# Altium project Servo-Board-v1.0.PrjPcb (part 2 of 19)

## Sheet Power_Sheet.SchDoc
size 420 x 297 mm; SheetNumber: 2; SheetTotal: 32
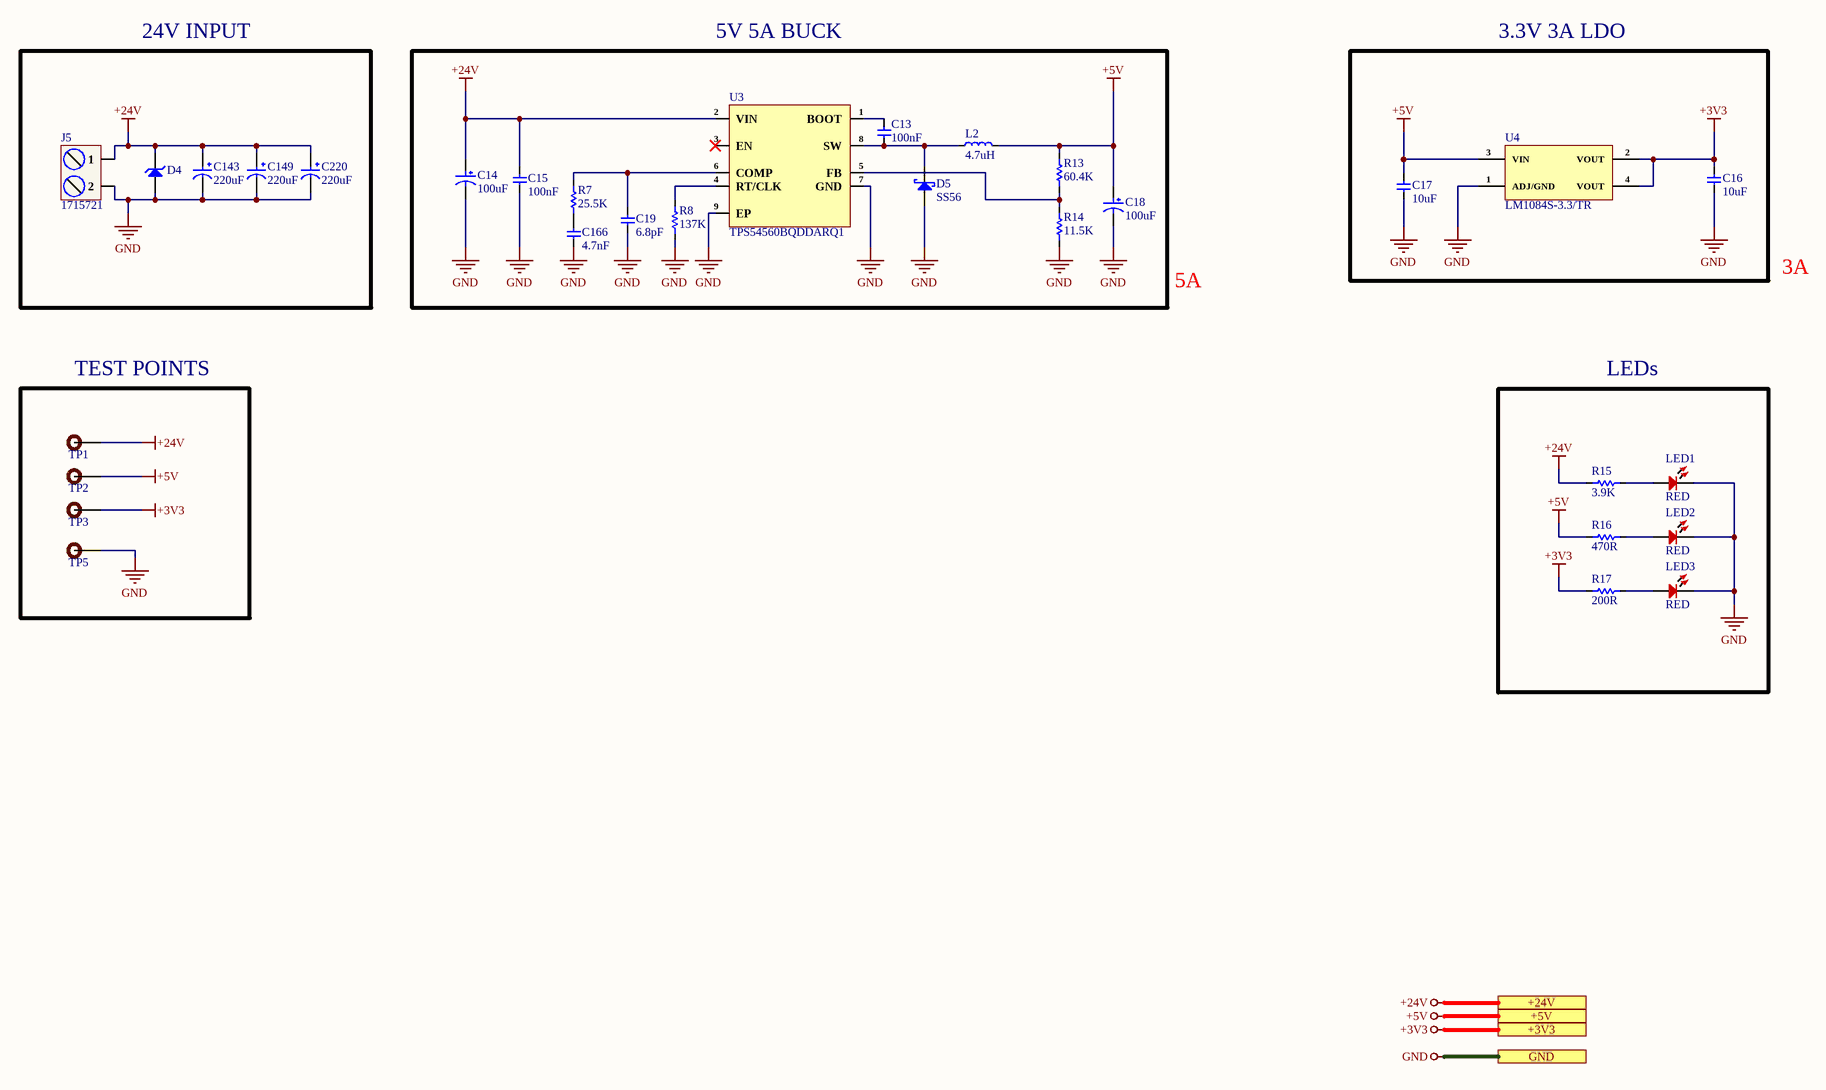
[diagram p2: Power_Sheet.SchDoc]

### Parts
C13  100nF  [cap-0402]
C14  100uF  [RVT1A101M0605]
C15  100nF  [cap-0402]
C16  10uF  [Cap-0603]
C17  10uF  [Cap-0603]
C18  100uF  [RVT1A101M0605]
C19  6.8pF  [Cap-0402]
C143  220uF  [UCD-220uF-10mmDia]
C149  220uF  [UCD-220uF-10mmDia]
C166  4.7nF  [Cap-0402]
C220  220uF  [UCD-220uF-10mmDia]
D4  SMBJ28A-13-F  [SMB_]  (value not drawn)
D5  SS56  [SMA]
J5  1715721  [1715721]
L2  4.7uH  [YSPI1050-4R7M]
LED1  RED  [LED-0603]
LED2  RED  [LED-0603]
LED3  RED  [LED-0603]
R7  25.5K  [Res-0402]
R8  137K  [Res-0402]
R13  60.4K  [Res-0402]
R14  11.5K  [Res-0402]
R15  3.9K  [Res-0402]
R16  470R  [Res-0402]
R17  200R  [Res-0402]
TP1  TEST POINT  [Test-point]  (value not drawn)  (no BOM)
TP2  TEST POINT  [Test-point]  (value not drawn)  (no BOM)
TP3  TEST POINT  [Test-point]  (value not drawn)  (no BOM)
TP5  TEST POINT  [Test-point]  (value not drawn)  (no BOM)
U3  TPS54560BQDDARQ1  [8-SO PowerPad]
U4  LM1084S-3.3/TR  [TO263-3_]

### Blocks framed on the sheet
24V INPUT: C143 C149 C220 D4 J5
5V 5A BUCK: C13-C15 C18 C19 C166 D5 L2 R7 R8 R13 R14 U3
3.3V 3A LDO: C16 C17 U4
TEST POINTS: TP1-TP3 TP5
LEDs: LED1-LED3 R15-R17

### Ports
+3V3 (see Top_Sheet[2A], CAN_Sheet[5D], Connector_Sheet[5D], Controller_Sheet[5D], Encoder_Sheet1[5D], Encoder_Sheet2[5D], Encoder_Sheet3[5D], Encoder_Sheet4[5D], EtherCAT_Sheet[5D], Motor_Driver_Sheet1[5D], Motor_Driver_Sheet2[5D], Motor_Driver_Sheet3[5D], Motor_Driver_Sheet4[5D], RJ45_Sheet[5D], RS485_RS232_Sheet[3D], Sec_Controller_Sheet1[5D], Sec_Controller_Sheet2[5D], Sec_Controller_Sheet3[5D], Sec_Controller_Sheet4[5D]), +5V (see Top_Sheet[2A], CAN_Sheet[5D], DIO_1[5D], DIO_2[5D], DIO_3[5D], DIO_4[5D], Encoder_Sheet1[5D], Encoder_Sheet2[5D], Encoder_Sheet3[5D], Encoder_Sheet4[5D]), +24V (see Top_Sheet[2A], Connector_Sheet[5D], DIO_1[5D], DIO_2[5D], DIO_3[5D], DIO_4[5D], MOSFET_Driver_Sheet1[5D], MOSFET_Driver_Sheet2[5D], MOSFET_Driver_Sheet3[5D], MOSFET_Driver_Sheet4[5D], Motor_Driver_Sheet1[5D], Motor_Driver_Sheet2[5D], Motor_Driver_Sheet3[5D], Motor_Driver_Sheet4[5D]), GND (see Top_Sheet[2A], CAN_Sheet[5D], Connector_Sheet[5D], Controller_Sheet[5D], DIO_1[5D], DIO_2[5D], DIO_3[5D], DIO_4[5D], Encoder_Sheet1[5D], Encoder_Sheet2[5D], Encoder_Sheet3[5D], Encoder_Sheet4[5D], EtherCAT_Sheet[5D], MOSFET_Driver_Sheet1[5D], MOSFET_Driver_Sheet2[5D], MOSFET_Driver_Sheet3[5D], MOSFET_Driver_Sheet4[5D], Motor_Driver_Sheet1[5D], Motor_Driver_Sheet2[5D], Motor_Driver_Sheet3[5D], Motor_Driver_Sheet4[5D], RJ45_Sheet[5D], RS485_RS232_Sheet[3D], Sec_Controller_Sheet1[5D], Sec_Controller_Sheet2[5D], Sec_Controller_Sheet3[5D], Sec_Controller_Sheet4[5D])

### Nets
+3V3: C16.2 R17.1 TP3.1 U4.2(VOUT) U4.4(VOUT) ; port +3V3
+5V: C17.2 C18.1 L2.2 R13.2 R16.1 TP2.1 U4.3(VIN) ; port +5V
+24V: C14.1 C15.2 C143.1 C149.1 C220.1 D4.2(K) J5.1 R15.1 TP1.1 U3.2(VIN) ; port +24V  [project net VDRAIN]
GND: C14.2 C15.1 C16.1 C17.1 C18.2 C19.1 C143.2 C149.2 C166.1 C220.2 D4.1(A) D5.2(A) J5.2 LED1.2 LED2.2 LED3.2 R8.1 R14.1 TP5.1 U3.7(GND) U3.9(EP) U4.1(ADJ/GND) ; port GND
NetC13_1: C13.1 D5.1(K) L2.1 U3.8(SW)
NetC13_2: C13.2 U3.1(BOOT)
NetC19_2: C19.2 R7.2 U3.6(COMP)
NetC166_2: C166.2 R7.1
NetLED1_1: LED1.1 R15.2
NetLED2_1: LED2.1 R16.2
NetLED3_1: LED3.1 R17.2
NetR8_2: R8.2 U3.4(RT/CLK)
NetR13_1: R13.1 R14.2 U3.5(FB)

Not connected (* = marked no-connect by the designer): U3 3(EN)*

### Notes on the sheet
- 3A
- 5A
- File:
- Title:
- Date:
- Page
- Num:
- Total:
- Drawn By: Huzaifa Ali

### Library data of the parts
C13 C15 = C1005X7R1H104KT000F: as C11 on sheet Controller_Sheet; Supplier 1: Avnet; Manufacturer Part Number: C1005X7R1H104KT000F; RoHS: No; Category: Ceramic Capacitors; Dielectric: X7R; Supplier Part Number 1: C1005X7R1H104KT000F; LCSC Part Number: C361198; ComponentLink1Description: LCSC; ComponentLink1URL: https://www.lcsc.com/product-detail/Multilayer-Ceramic-Capacitors-MLCC-SMD-SMT_TDK-C1005X7R1H104KT000F_C361198.html
C14 C18 = RVT1A101M0605: 100uF 10V 55mA@120Hz ±20% SMD,D6.3xL5.4mm Aluminum Electrolytic Capacitors - SMD ROHS; Manufacturer: ROQANG; Manufacturer Part Number: RVT1A101M0605; Package: SMD,D6.3xL5.4mm; LCSC Part Number: C72474; Item Type: Capacitor; ComponentLink1Description: LCSC; ComponentLink1URL: https://www.lcsc.com/product-detail/Aluminum-Electrolytic-Capacitors-SMD_ROQANG-RVT1A101M0605_C72474.html
C16 C17 = C1608X5R1E106M080AC: CAP CER 10UF 25V X5R 0603; Manufacturer: TDK; Dielectric Material: Ceramic; Tolerance: 20%; Item Type: Capacitor; Supplier 1: Digi-Key; Manufacturer Part Number: C1608X5R1E106M080AC; Stock 1: 61681; Pricing 1: 1=0.96, 10=0.704, 100=0.483, 500=0.38238, 1000=0.322 (USD); Mount: Surface Mount; Case/Package: 0603; Weight: 7.1E-05oz; Case Code (Imperial): 0603; Case Code (Metric): 1608; Min Operating Temperature: -55°C; Max Operating Temperature: 85°C; Capacitance: 10uF; Packaging: Tape and Reel; Voltage Rating: 25V; Voltage Rating (DC): 25V; Termination: SMD/SMT; Package Quantity: 1; Dielectric: X5R; Composition: Ceramic; Length: 1.6mm; Height: 0.8mm; Width: 0.8mm; Thickness: 0.039inch; Depth: 0.8mm; Lead Free: Lead Free; REACH SVHC: No SVHC; Supplier Part Number 1: 445-9015-1-ND; LCSC Part Number: C2168289
C19 = CC0402CRNPO9BN6R8: as C3 on sheet Controller_Sheet; Supplier: Future Electronics; Supplier Part Number: 3247368; Manufacturer Part Number: CC0402CRNPO9BN6R8; RoHS: Yes; Category: Ceramic Capacitors; Stock: 200000; Pricing: 10000=0.0024, 40000=0.0022, 150000=0.0021, 400000=0.002, 1000000=0.0019 (USD); Mounting Technology: Surface Mount; Case/Package: 0402; Case Code (Imperial): 0402; Case Code (Metric): 1005; Weight: 2.3E-05oz; Min Operating Temperature: -55°C; Max Operating Temperature: 125°C; Value: 6.8pF; Packaging: Tape and Reel; Voltage Rating: 50V; Voltage Rating (DC): 50V; Termination: SMD/SMT; Series: CC; Construction: Flat; Length: 1mm; Width: 0.5mm; Height: 0.5mm; Depth: 0.5mm; Radiation Hardening: No; RoHS Compliant: Yes; ComponentLink1URL: https://datasheet.ciiva.com/11587/upy-gp-np0-16v-to-50v-8-11587182.pdf?src-supplier=Avnet; ComponentLink1Description: https://datasheet.ciiva.com/11587/upy-gp-np0-16v-to-50v-8-11587182.pdf?src-supplier=Avnet; LCSC Part Number: C189470
C143 C149 C220 = UCD1H221MNL1GS: CAP ALUM 220UF 20% 50V SMD; Manufacturer: Nichicon; Ripple Current: 700mA; Impedance: 160mR; Leakage Current: 3uA; Life (Hours): 5000Hour; Dissipation Factor: 0.1%; Item Type: Capacitor; Supplier 1: Digi-Key; Manufacturer Part Number: UCD1H221MNL1GS; RoHS: Yes; Category: Aluminum Electrolytic Capacitors; Pricing 1: 1=0.85000, 10=0.60200, 50=0.45480, 100=0.39620 (USD); Mount: Surface Mount,PCB; Case/Package: Radial; Min Operating Temperature: -55°C; Max Operating Temperature: 105°C; Capacitance: 220uF; Tolerance: 20%; Voltage Rating: 50V; Packaging: Tape and Reel; Package Quantity: 1; Voltage Rating (DC): 50V; Termination: SMD/SMT; Voltage: 50V; Features: General Purpose; Series: CD; Construction: Cylindrical; Diameter: 10mm; Length: 10mm; Height: 10mm; Height - Seated (Max): 0.394inch; Radiation Hardening: No; Lead Free: Lead Free; RoHS Compliant: Yes; ComponentLink1URL: https://datasheet.ciiva.com/11776/0900766b80ebdadd-11776792.pdf?src-supplier=RSComponents; ComponentLink1Description: https://datasheet.ciiva.com/11776/0900766b80ebdadd-11776792.pdf?src-supplier=RSComponents; ComponentLink2URL: https://datasheet.ciiva.com/5362/e-cd-22158-5362489.pdf?src-supplier=Mouser; ComponentLink2Description: https://datasheet.ciiva.com/5362/e-cd-22158-5362489.pdf?src-supplier=Mouser; ComponentLink3URL: https://datasheet.ciiva.com/11684/e-cd-11684678.pdf?src-supplier=Avnet; ComponentLink3Description: https://datasheet.ciiva.com/11684/e-cd-11684678.pdf?src-supplier=Avnet; ComponentLink4URL: https://datasheet.ciiva.com/15037/e-cd-15037119.pdf?src-supplier=Digi-Key; ComponentLink4Description: https://datasheet.ciiva.com/15037/e-cd-15037119.pdf?src-supplier=Digi-Key; ComponentLink5URL: https://datasheet.ciiva.com/16393/e-cd-16393493.pdf?src-supplier=Future+Electronics; ComponentLink5Description: https://datasheet.ciiva.com/16393/e-cd-16393493.pdf?src-supplier=Future+Electronics; ComponentLink6URL: https://datasheet.ciiva.com/17354/e-cd-17354606.pdf?src-supplier=Avnet+Europe; ComponentLink6Description: https://datasheet.ciiva.com/17354/e-cd-17354606.pdf?src-supplier=Avnet+Europe; Supplier Part Number 1: 493-6390-1-ND; LCSC Part Number: C116211
C166 = CC0402KRX7R9BB472: CAP CER 4700PF 50V X7R 0402; Manufacturer: Yageo; Material: 4241ConductorMaterial; Tolerance: 10%; Temperature Coefficient: 30ppm/°C; Item Type: Capacitor; Supplier 1: Future Electronics; Manufacturer Part Number: CC0402KRX7R9BB472; RoHS: Yes; Category: Ceramic Capacitors; Stock 1: 1780000; Pricing 1: 10000=0.0021, 40000=0.002, 150000=0.0019, 400000=0.0018, 1000000=0.0017 (USD); Mount: Surface Mount; Case/Package: 0402; Number of Pins: 2NUMBER; Case Code (Imperial): 0402; Case Code (Metric): 1005; Min Operating Temperature: -55°C; Max Operating Temperature: 125°C; Capacitance: 4.7nF; Dielectric: X7R; Voltage Rating: 50V; Voltage Rating (DC): 50V; Packaging: Tape and Reel; Package Quantity: 1; Termination: SMD/SMT; Series: CC; Construction: Flat; Length: 1mm; Width: 0.02inch; Height: 0.5mm; Thickness: 0.022inch; Depth: 0.5mm; Radiation Hardening: No; Reach SVHC Compliant: No; RoHS Compliant: Yes; Halogen Free: 5694HalogenFree; Lead Free: 5697LeadFree; ComponentLink1URL: https://datasheet.ciiva.com/7978/1489800-7978108.pdf?src-supplier=Element14; ComponentLink1Description: https://datasheet.ciiva.com/7978/1489800-7978108.pdf?src-supplier=Element14; ComponentLink2URL: https://datasheet.ciiva.com/176/mlccorderingcode-176364.pdf?src-supplier=Digikey; ComponentLink2Description: https://datasheet.ciiva.com/176/mlccorderingcode-176364.pdf?src-supplier=Digikey; ComponentLink3URL: https://datasheet.ciiva.com/176/mlccorderingcode-176363.pdf?src-supplier=Digikey; ComponentLink3Description: https://datasheet.ciiva.com/176/mlccorderingcode-176363.pdf?src-supplier=Digikey; ComponentLink4URL: https://datasheet.ciiva.com/176/mlccorderingcode-176365.pdf?src-supplier=Digikey; ComponentLink4Description: https://datasheet.ciiva.com/176/mlccorderingcode-176365.pdf?src-supplier=Digikey; ComponentLink5URL: https://datasheet.ciiva.com/11586/upy-gphc-x7r-6-3v-to-50v-8-11586491.pdf?src-supplier=Avnet; ComponentLink5Description: https://datasheet.ciiva.com/11586/upy-gphc-x7r-6-3v-to-50v-8-11586491.pdf?src-supplier=Avnet; Supplier Part Number 1: 1989300
D4 = SMBJ28A-13-F: TVS DIODE 28VWM 45.4VC SMB; Manufacturer: Diodes; Test Current: 1mA; Number of Elements: 1; Power Dissipation: 600W; Forward Voltage: 5V; Direction: Unidirectional; Reverse Breakdown Voltage: 31.1V; Max Surge Current: 13.2A; Reverse Standoff Voltage: 28V; Clamping Voltage: 45.4V; Power Line Protection: No; Breakdown Voltage: 35.8V; Max Reverse Leakage Current: 5uA; Value: 330pF; Diode Type: ZENER; Supplier: Future Electronics; Supplier Part Number: 8797342; Manufacturer Part Number: SMBJ28A-13-F; RoHS: Yes; Category: TVS Diodes; Stock: 39000; Pricing: 3000=0.0734, 9000=0.0706, 15000=0.0693, 30000=0.0676, 60000=0.065 (USD); Mounting Technology: Surface Mount; Case/Package: SMB; Pins: 2; Min Operating Temperature: -55°C; Max Operating Temperature: 150°C; Packaging: Tape and Reel; Package Quantity: 3000; Max Power Dissipation: 600W; Series: SMBJ; Number of Unidirectional Channels: 1; Min Breakdown Voltage: 31.1V; Peak Pulse Power: 600W; Polarity: Unidirectional; Termination: SMD/SMT; Peak Pulse Current: 13.2A; Max Breakdown Voltage: 35.8V; Leakage Current: 5uA; Working Voltage: 28V; Voltage Rating (DC): 28V; Max Output current: 13.2A; Clamping Voltage-Max: 45.4V; Length: 4.57mm; Width: 3.9mm; Height: 2.62mm; Radiation Hardening: No; RoHS Compliant: Yes; Lead Free: Lead Free; ComponentLink1URL: https://datasheet.ciiva.com/16387/ds19002-16387564.pdf?src-supplier=Future+Electronics; ComponentLink1Description: https://datasheet.ciiva.com/16387/ds19002-16387564.pdf?src-supplier=Future+Electronics; ComponentLink2URL: https://datasheet.ciiva.com/26912/getdatasheetpartid-234000-26912533.pdf?src-supplier=Verical; ComponentLink2Description: https://datasheet.ciiva.com/26912/getdatasheetpartid-234000-26912533.pdf?src-supplier=Verical; Item Type: Diode
D5 = SS56: DIODE SCHOTTKY 60V 5A SMA; Manufacturer: MDD; LCSC Par Number: C65009; Manufacturer Part Number: SS56; Iterm Type: Diode; ComponentLink1Description: LCSC; ComponentLink1URL: https://www.lcsc.com/product-detail/Schottky-Barrier-Diodes-SBD_MDD-Microdiode-Electronics-SS56_C65009.html
J5 = 1715721: TERM BLK 2P SIDE ENT 5.08MM PCB; Manufacturer: Phoenix Contact; Item Type: Terminal Blocks; Supplier: Digikey; Supplier Part Number: 277-1263-ND; Manufacturer Part Number: 1715721; RoHS: Yes; Stock: 13160; Pricing: 1=0.94 (USD); ComponentLink1URL: https://datasheet.ciiva.com/1120/1697161-1120393.pdf?src-supplier=Farnell; ComponentLink1Description: https://datasheet.ciiva.com/1120/1697161-1120393.pdf?src-supplier=Farnell; ComponentLink2URL: https://datasheet.ciiva.com/832/1715721-832095.pdf?src-supplier=Digikey; ComponentLink2Description: https://datasheet.ciiva.com/832/1715721-832095.pdf?src-supplier=Digikey; ComponentLink3URL: https://datasheet.ciiva.com/15169/getdatasheetpartid-212174-15169929.pdf?src-supplier=Verical; ComponentLink3Description: https://datasheet.ciiva.com/15169/getdatasheetpartid-212174-15169929.pdf?src-supplier=Verical; ComponentLink4URL: https://datasheet.ciiva.com/16046/1715721-16046034.pdf?src-supplier=Onlinecomponents.com; ComponentLink4Description: https://datasheet.ciiva.com/16046/1715721-16046034.pdf?src-supplier=Onlinecomponents.com
L2 = YSPI1050-4R7M: 8A 4.7uH ±20% SMD,10x10.1mm Power Inductors ROHS; Manufacturer: YJYCOIN; Manufacturer Part Number: YSPI1050-4R7M; Package: SMD,10.1x10.1mm; LCSC Part Number: C497895; Item Type: Inductor; ComponentLink1Description: LCSC; ComponentLink1URL: https://www.lcsc.com/product-detail/Power-Inductors_YJYCOIN-YSPI1050-4R7M_C497895.html
LED1-LED3 = NCD0603R3: RED LED 0603 Light Emitting Diodes; Manufacturer: Foshan NationStar Optoelectronics; Manufacturer Part Number: NCD0603R3; Package: 0603; Item Type: LED; LCSC Part Number: C3151730; ComponentLink1Description: LCSC; ComponentLink1URL: https://www.lcsc.com/product-detail/Light-Emitting-Diodes-LED_Foshan-NationStar-Optoelectronics-NCD0603R3_C3151730.html
R7 = 0402WGF2552TCE: 62.5mW Thick Film Resistors 50V ±100ppm/℃ ±1% 25.5kΩ 0402 Chip Resistor - Surface Mount ROHS; Manufacturer: Royal Electronic Factory; Value: 25.5kR; Supplier: Mouser; LCSC Part Number: C26970; Manufacturer Part Number: 0402WGF2552TCE; RoHS: Yes; Item Type: Resistor; Pricing: 10000=0.004 (USD); RoHS Compliant: Yes
R8 = RT0402BRD07137KL: RES SMD 137K OHM 0.1% 1/16W 0402; Manufacturer: Yageo; Item Type: Resistors; Value: 137kR; Max Power Dissipation: 63mW; Temperature Coefficient: 25ppm/°C; Voltage Rating: 50V; Supplier: Digikey; LCSC Part Number: C852519; Manufacturer Part Number: RT0402BRD07137KL; RoHS: Yes; Stock: 18830; Pricing: 1=0.2, 10=0.15, 50=0.1174, 100=0.1051, 500=0.07972, 1000=0.07035, 5000=0.05199 (USD); Case/Package: 0402; Min Operating Temperature: -55°C; Max Operating Temperature: 155°C; Packaging: Tape and Reel; Number of Terminations: 2; Tolerance: 0.1%; Features: Moisture Resistant; Series: RT; Length: 0.039inch; Width: 0.02inch; Height: 0.014inch; ComponentLink1URL: http://www.yageo.com/documents/recent/PYu-RT_1-to-0.01_RoHS_L_8.pdf?src-supplier=Digikey; ComponentLink1Description: http://www.yageo.com/documents/recent/PYu-RT_1-to-0.01_RoHS_L_8.pdf?src-supplier=Digikey
R13 = SCR0402F60K4: 60.4kΩ 50V 62.5mW Thick Film Resistors ±1% 0402 Chip Resistor - Surface Mount ROHS; Manufacturer: VO; Manufacturer Part Number: SCR0402F60K4; Package: 0402; LCSC Part Number: C3016055; Item Type: Resistor; ComponentLink1Description: LCSC; ComponentLink1URL: https://www.lcsc.com/product-detail/Chip-Resistor-Surface-Mount_VO-SCR0402F60K4_C3016055.html
R14 = FRC0402F1152TS: 11.5kΩ 50V 62.5mW Thick Film Resistors ±100ppm/℃ ±1%  0402 Chip Resistor - Surface Mount ROHS; Manufacturer: FOJAN; Manufacturer Part Number: FRC0402F1152TS; Package: 0402; LCSC Part Number: C2933068; Item Type: Resistor; ComponentLink1Description: LCSC; ComponentLink1URL: https://www.lcsc.com/product-detail/Chip-Resistor-Surface-Mount_FOJAN-FRC0402F1152TS_C2933068.html
R15 = RC0402FR-073K9L: RES 3.9K OHM 1% 1/16W 0402; Manufacturer: Yageo; Temperature Coefficient: 100ppm/°C; Power Rating: 62.5mW; Value: 3.9kR; Voltage Rating: 50V; Max Power Dissipation: 63mW; Item Type: Resistor; Supplier: Future Electronics; Supplier Part Number: 9808155; Manufacturer Part Number: RC0402FR-073K9L; RoHS: Yes; Category: Chip SMD Resistors; Stock: 6910000; Pricing: 10000=0.0011, 100000=0.0011, 300000=0.001, 750000=0.001, 2000000=0.0009 (USD); Case/Package: 0402; Case Code (Imperial): 0402; Case Code (Metric): 1005; Min Operating Temperature: -55°C; Max Operating Temperature: 155°C; Tolerance: 1%; Packaging: Tape and Reel; Resistor Type: Thick Film; Series: RC; Termination: SMD/SMT; Number of Terminations: 2; Features: Moisture Resistant; Resistance Tolerance: 1%; Construction: Rectangular; Voltage Rating (AC): 50V; Length: 1mm; Depth: 0.5mm; Lead Free: Lead Free; RoHS Compliant: Yes; Reach SVHC Compliant: Unknown; Military Standard: Not; ComponentLink1URL: https://datasheet.ciiva.com/12666/pyu-rc0402-51-rohs-l-6-r-12666997.pdf?src-supplier=Mouser; ComponentLink1Description: https://datasheet.ciiva.com/12666/pyu-rc0402-51-rohs-l-6-r-12666997.pdf?src-supplier=Mouser; ComponentLink2URL: https://datasheet.ciiva.com/7849/1018594-7849989.pdf?src-supplier=Element14; ComponentLink2Description: https://datasheet.ciiva.com/7849/1018594-7849989.pdf?src-supplier=Element14; ComponentLink3URL: https://datasheet.ciiva.com/7849/1018594-7849990.pdf?src-supplier=Element14; ComponentLink3Description: https://datasheet.ciiva.com/7849/1018594-7849990.pdf?src-supplier=Element14; ComponentLink4URL: https://datasheet.ciiva.com/15189/getdatasheetpartid-469246-15189453.pdf?src-supplier=Verical; ComponentLink4Description: https://datasheet.ciiva.com/15189/getdatasheetpartid-469246-15189453.pdf?src-supplier=Verical; LCSC Part Number: C131467
R16 = RC0402FR-07470RL: RES 470 OHM 1% 1/16W 0402; Manufacturer: Yageo; Item Type: Resistor; Voltage Rating: 50V; Power Rating: 62.5mW; Temperature Coefficient: 100ppm/°C; Max Power Dissipation: 63mW; Supplier: Avnet; Supplier Part Number: RC0402FR-07470RL; Manufacturer Part Number: RC0402FR-07470RL; RoHS: Yes; Stock: 10000; Pricing: 10000=0.00085 (USD); Case/Package: 0402; Case Code (Metric): 1005; Case Code (Imperial): 0402; Min Operating Temperature: -55°C; Max Operating Temperature: 155°C; Packaging: Tape and Reel; Value: 470R; Tolerance: 1%; Number of Terminations: 2; Working Voltage: 50V; Package Quantity: 1; Resistor Type: Thick Film; Termination: SMD/SMT; Features: Moisture Resistant; Series: RC; Resistance Tolerance: 1%; Construction: Rectangular; Voltage Rating (AC): 50V; Length: 1mm; Width: 0.02inch; Height: 0.016inch; Depth: 0.5mm; Lead Free: Lead Free; Reach SVHC Compliant: No; RoHS Compliant: Yes; Military Standard: Not; ComponentLink1URL: https://datasheet.ciiva.com/46412/1018594-46412838.pdf?src-supplier=Element14; ComponentLink1Description: https://datasheet.ciiva.com/46412/1018594-46412838.pdf?src-supplier=Element14; ComponentLink2URL: https://datasheet.ciiva.com/2453/pyu-r-int-thick-7-2453377.pdf?src-supplier=Digikey; ComponentLink2Description: https://datasheet.ciiva.com/2453/pyu-r-int-thick-7-2453377.pdf?src-supplier=Digikey; ComponentLink3URL: https://datasheet.ciiva.com/2453/pyu-r-int-thick-7-2453378.pdf?src-supplier=Digikey; ComponentLink3Description: https://datasheet.ciiva.com/2453/pyu-r-int-thick-7-2453378.pdf?src-supplier=Digikey; ComponentLink4URL: https://datasheet.ciiva.com/2453/pyu-r-int-thick-7-2453376.pdf?src-supplier=Digikey; ComponentLink4Description: https://datasheet.ciiva.com/2453/pyu-r-int-thick-7-2453376.pdf?src-supplier=Digikey; ComponentLink5URL: https://datasheet.ciiva.com/7850/1018594-7850015.pdf?src-supplier=Element14; ComponentLink5Description: https://datasheet.ciiva.com/7850/1018594-7850015.pdf?src-supplier=Element14; ComponentLink6URL: https://datasheet.ciiva.com/7850/1018594-7850014.pdf?src-supplier=Element14; ComponentLink6Description: https://datasheet.ciiva.com/7850/1018594-7850014.pdf?src-supplier=Element14; ComponentLink7URL: https://datasheet.ciiva.com/15189/getdatasheetpartid-330246-15189463.pdf?src-supplier=Verical; ComponentLink7Description: https://datasheet.ciiva.com/15189/getdatasheetpartid-330246-15189463.pdf?src-supplier=Verical; LCSC Part Number: C114877
R17 = RC0402FR-07200RL: RES 200 OHM 1% 1/16W 0402; Manufacturer: Yageo; Temperature Coefficient: 100ppm/°C; Power Rating: 63mW; Voltage Rating (DC): 50V; Supplier 1: Digi-Key; Manufacturer Part Number: RC0402FR-07200RL; RoHS: Yes; Category: Chip SMD Resistors; Stock 1: 19778; Pricing 1: 1=0.10000, 10=0.01600, 100=0.00660, 1000=0.00299, 2500=0.00259, 5000=0.00214 (USD); Case/Package: 0402; Case Code (Metric): 1005; Case Code (Imperial): 0402; Size Code: 0402; Min Operating Temperature: -55°C; Max Operating Temperature: 155°C; Tolerance: 1%; Resistance: 200R; Resistor Type: Thick Film; Packaging: Tape and Reel; Voltage Rating: 50V; Package Quantity: 1; Number of Terminations: 2; Termination: SMD/SMT; Max Power Dissipation: 63mW; Features: Moisture Resistant; Series: RC; Construction: Rectangular; Resistance Tolerance: 1%; Length: 1mm; Width: 0.02inch; Height: 0.016inch; Depth: 0.5mm; REACH SVHC: No SVHC; Lead Free: Lead Free; RoHS Compliant: Yes; Military Standard: Not; ComponentLink1URL: https://datasheet.ciiva.com/2553/pyu-r-int-thick-7-2553232.pdf?src-supplier=Digi-Key; ComponentLink1Description: https://datasheet.ciiva.com/2553/pyu-r-int-thick-7-2553232.pdf?src-supplier=Digi-Key; ComponentLink2URL: https://datasheet.ciiva.com/7983/1018594-7983509.pdf?src-supplier=Element14; ComponentLink2Description: https://datasheet.ciiva.com/7983/1018594-7983509.pdf?src-supplier=Element14; ComponentLink3URL: https://datasheet.ciiva.com/16804/pyu-rc0402-51-rohs-l-6-r-16804406.pdf?src-supplier=Future+Electronics; ComponentLink3Description: https://datasheet.ciiva.com/16804/pyu-rc0402-51-rohs-l-6-r-16804406.pdf?src-supplier=Future+Electronics; ComponentLink4URL: https://datasheet.ciiva.com/15189/getdatasheetpartid-331152-15189383.pdf?src-supplier=Verical; ComponentLink4Description: https://datasheet.ciiva.com/15189/getdatasheetpartid-331152-15189383.pdf?src-supplier=Verical; ComponentLink5URL: https://datasheet.ciiva.com/7849/1018594-7849898.pdf?src-supplier=Element14; ComponentLink5Description: https://datasheet.ciiva.com/7849/1018594-7849898.pdf?src-supplier=Element14; ComponentLink6URL: https://datasheet.ciiva.com/5562/pyu-rc0402-51-rohs-l-6-r-8721-5562539.pdf?src-supplier=Mouser; ComponentLink6Description: https://datasheet.ciiva.com/5562/pyu-rc0402-51-rohs-l-6-r-8721-5562539.pdf?src-supplier=Mouser; ComponentLink7URL: https://datasheet.ciiva.com/7849/1018594-7849899.pdf?src-supplier=Element14; ComponentLink7Description: https://datasheet.ciiva.com/7849/1018594-7849899.pdf?src-supplier=Element14; ComponentLink8URL: https://datasheet.ciiva.com/2553/pyu-r-int-thick-7-2553230.pdf?src-supplier=Digi-Key; ComponentLink8Description: https://datasheet.ciiva.com/2553/pyu-r-int-thick-7-2553230.pdf?src-supplier=Digi-Key; ComponentLink9URL: https://datasheet.ciiva.com/2553/pyu-r-int-thick-7-2553231.pdf?src-supplier=Digi-Key; ComponentLink9Description: https://datasheet.ciiva.com/2553/pyu-r-int-thick-7-2553231.pdf?src-supplier=Digi-Key; Supplier Part Number 1: 311-200LRCT-ND; LCSC Part Number: C114764
TP1-TP3 TP5 = TEST POINT: Test Point ON; Item Type: TEST POINT
U3 = TPS54560BQDDARQ1: IC REG BCK SPLIT RAIL ADJ 8SOPWR; Manufacturer: Texas Instruments; Max Supply Voltage: 60V; Min Supply Voltage: 4.5V; Nominal Supply Current: 146uA; Supplier: Mouser; Supplier Part Number: 595-TPS54560BQDDARQ1; Manufacturer Part Number: TPS54560BQDDARQ1; RoHS: Yes; Item Type: IC; Stock: 1171; Pricing: 1=6.41, 10=5.44, 50=5.44, 100=4.7, 1000=3.4, 10000=3.29 (USD); Length: 4.89mm; Width: 3.9mm; Height: 1.7mm; Thickness: 1.48mm; ComponentLink1URL: http://www.ti.com/lit/ds/symlink/tps54560b-q1.pdf?src-supplier=Digikey; ComponentLink1Description: http://www.ti.com/lit/ds/symlink/tps54560b-q1.pdf?src-supplier=Digikey; LCSC Part Number: C2072188
U4 = LM1084S-3.3/TR: 72dB@(120Hz) 5A Fixed 3.3V~3.3V Positive 12V TO-263-3 Linear Voltage Regulators (LDO) ROHS; Manufacturer: HGSEMI; Item Type: IC; Manufacturer Part Number: LM1084S-3.3/TR; Package: TO-263-3; LCSC Part Number: C259972; ComponentLink1Description: LCSC; ComponentLink1URL: https://www.lcsc.com/product-detail/Linear-Voltage-Regulators-LDO_HGSEMI-LM1084S-3-3-TR_C259972.html

## Sheet CAN_Sheet.SchDoc
size 420 x 297 mm; SheetNumber: 4; SheetTotal: 32
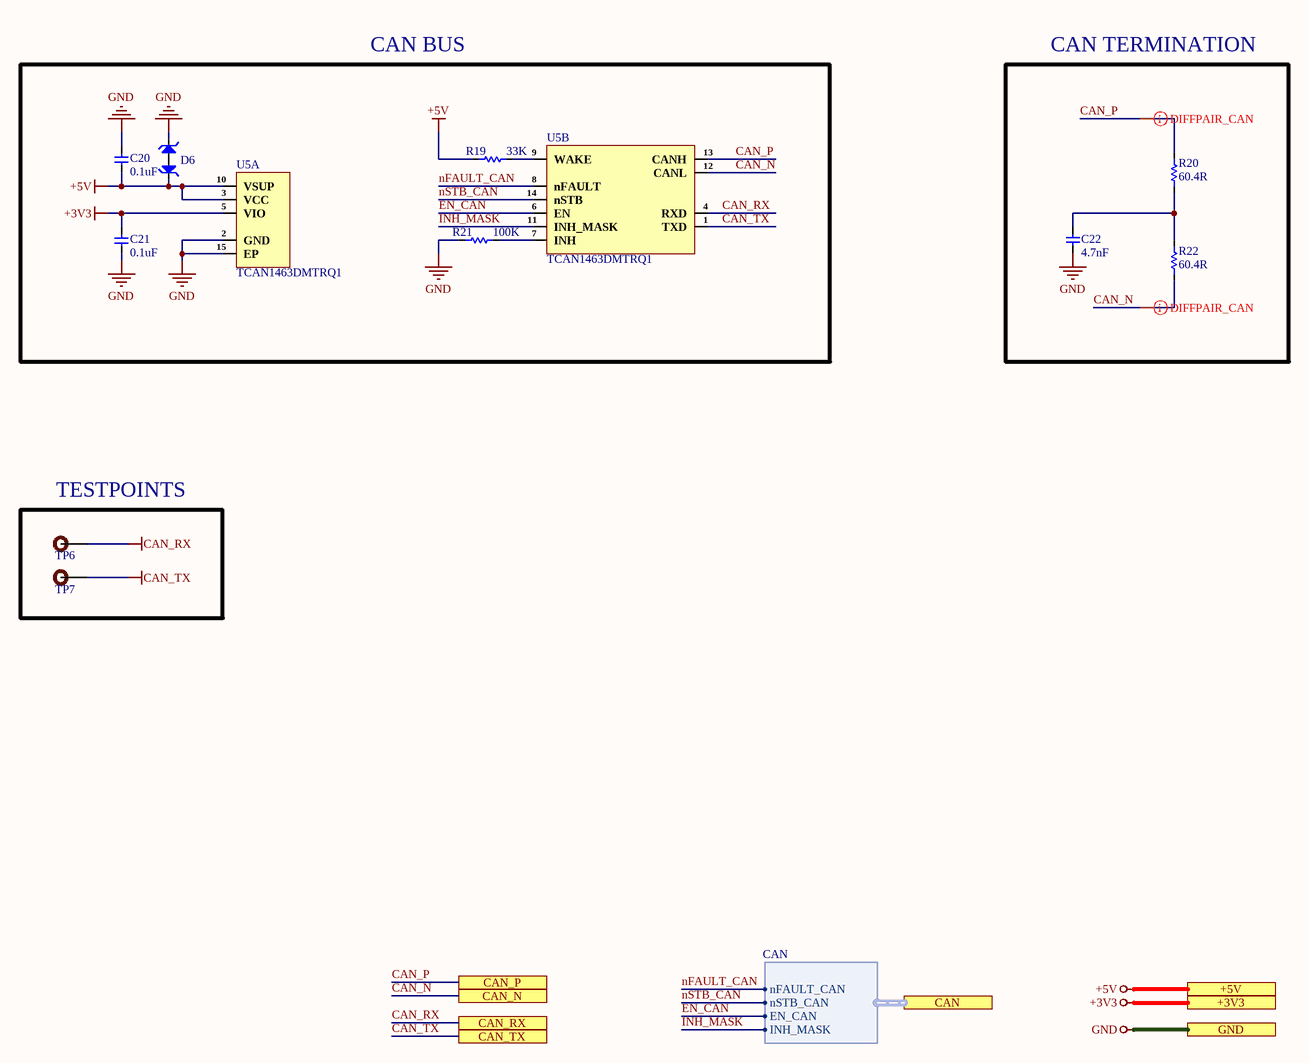
[diagram p3: CAN_Sheet.SchDoc]

### Parts
C20  0.1uF  [Cap-0402]
C21  0.1uF  [Cap-0402]
C22  4.7nF  [Cap-0402]
D6  PESD5V0H1BSFYL  [DSN0603-2]  (value not drawn)
R19  33K  [Res-0402]
R20  60.4R  [Res-0603]
R21  100K  [Res-0402]
R22  60.4R  [Res-0603]
TP6  TEST POINT  [Test-point]  (value not drawn)  (no BOM)
TP7  TEST POINT  [Test-point]  (value not drawn)  (no BOM)
U5  TCAN1463DMTRQ1  [VSON-14(3x4.5)]  (parts A,B of 2)

### Ports
+3V3 (see Top_Sheet[3C], Connector_Sheet[5D], Controller_Sheet[5D], Encoder_Sheet1[5D], Encoder_Sheet2[5D], Encoder_Sheet3[5D], Encoder_Sheet4[5D], EtherCAT_Sheet[5D], Motor_Driver_Sheet1[5D], Motor_Driver_Sheet2[5D], Motor_Driver_Sheet3[5D], Motor_Driver_Sheet4[5D], Power_Sheet[5D], RJ45_Sheet[5D], RS485_RS232_Sheet[3D], Sec_Controller_Sheet1[5D], Sec_Controller_Sheet2[5D], Sec_Controller_Sheet3[5D], Sec_Controller_Sheet4[5D]), +5V (see Top_Sheet[3C], DIO_1[5D], DIO_2[5D], DIO_3[5D], DIO_4[5D], Encoder_Sheet1[5D], Encoder_Sheet2[5D], Encoder_Sheet3[5D], Encoder_Sheet4[5D], Power_Sheet[5D], Sec_Controller_Sheet1[5D], Sec_Controller_Sheet2[5D], Sec_Controller_Sheet3[5D], Sec_Controller_Sheet4[5D]), CAN (harness CAN, see Top_Sheet[4C], Controller_Sheet[4D]), CAN_N, CAN_P, CAN_RX (see Top_Sheet[3C], Controller_Sheet[3D]), CAN_TX (see Top_Sheet[3C], Controller_Sheet[3D]), GND (see Top_Sheet[3C], Connector_Sheet[5D], Controller_Sheet[5D], DIO_1[5D], DIO_2[5D], DIO_3[5D], DIO_4[5D], Encoder_Sheet1[5D], Encoder_Sheet2[5D], Encoder_Sheet3[5D], Encoder_Sheet4[5D], EtherCAT_Sheet[5D], MOSFET_Driver_Sheet1[5D], MOSFET_Driver_Sheet2[5D], MOSFET_Driver_Sheet3[5D], MOSFET_Driver_Sheet4[5D], Motor_Driver_Sheet1[5D], Motor_Driver_Sheet2[5D], Motor_Driver_Sheet3[5D], Motor_Driver_Sheet4[5D], Power_Sheet[5D], RJ45_Sheet[5D], RS485_RS232_Sheet[3D], Sec_Controller_Sheet1[5D], Sec_Controller_Sheet2[5D], Sec_Controller_Sheet3[5D], Sec_Controller_Sheet4[5D])

### Harnesses
CAN: nFAULT_CAN, nSTB_CAN, EN_CAN, INH_MASK

### Nets
+3V3: C21.2 U5.5(VIO) ; port +3V3
+5V: C20.1 D6.1 R19.1 U5.3(VCC) U5.10(VSUP) ; port +5V
CAN_RX: TP6.1 U5.4(RXD) ; port CAN_RX
CAN_TX: TP7.1 U5.1(TXD) ; port CAN_TX
GND: C20.2 C21.1 C22.2 D6.2 R21.1 U5.2(GND) U5.15(EP) ; port GND
CAN_N: R22.2 U5.12(CANL) ; port CAN_N
CAN_P: R20.1 U5.13(CANH) ; port CAN_P
EN_CAN: U5.6(EN) ; port CAN.EN_CAN
INH_MASK: U5.11(INH_MASK) ; port CAN.INH_MASK
nFAULT_CAN: U5.8(nFAULT) ; port CAN.nFAULT_CAN
nSTB_CAN: U5.14(nSTB) ; port CAN.nSTB_CAN
NetC22_1: C22.1 R20.2 R22.1
NetR19_2: R19.2 U5.9(WAKE)
NetR21_2: R21.2 U5.7(INH)

### Layout directives
differential pair; net class CAN; differential pair class CAN_Lines: CAN_N, CAN_P

### Notes on the sheet
- CAN BUS
- CAN TERMINATION
- (near TP6) TESTPOINTS
- File:
- Title:
- Date:
- Page
- Num:
- Total:
- Drawn By: Huzaifa Ali

### Library data of the parts
C20 C21 = CC0402JRX7R7BB104: as C1 on sheet Controller_Sheet; Supplier: Digikey; Supplier Part Number: 311-1676-1-ND; Manufacturer Part Number: CC0402JRX7R7BB104; RoHS: Yes; Category: Ceramic Capacitors; Stock: 1659111; Pricing: 1=0.1, 10=0.046, 50=0.0262, 100=0.0203, 500=0.01528, 1000=0.012, 2500=0.01091, 5000=0.01004 (USD); Mounting Technology: Surface Mount; Case/Package: 0402; Case Code (Metric): 1005; Case Code (Imperial): 0402; Min Operating Temperature: -55°C; Max Operating Temperature: 125°C; Dielectric: X7R; Packaging: Tape and Reel; Package Quantity: 10000; Voltage Rating (DC): 16V; Voltage Rating: 16V; Series: CC; Construction: Flat; Length: 0.039inch; Width: 0.02inch; Height: 0.5mm; Thickness: 0.022inch; Lead Free: Lead Free; Halogen Free: Halogen Free; RoHS Compliant: Yes; ComponentLink1URL: https://datasheet.ciiva.com/13210/upy-gphc-x7r-6-3v-to-50v-8-12304-13210152.pdf?src-supplier=Mouser; ComponentLink1Description: https://datasheet.ciiva.com/13210/upy-gphc-x7r-6-3v-to-50v-8-12304-13210152.pdf?src-supplier=Mouser; LCSC Part Number: C541464
C22 = CC0402KRX7R9BB472: as C166 on sheet Power_Sheet; Supplier 1: Future Electronics; Manufacturer Part Number: CC0402KRX7R9BB472; RoHS: Yes; Category: Ceramic Capacitors; Stock 1: 1780000; Pricing 1: 10000=0.0021, 40000=0.002, 150000=0.0019, 400000=0.0018, 1000000=0.0017 (USD); Mount: Surface Mount; Case/Package: 0402; Number of Pins: 2NUMBER; Case Code (Imperial): 0402; Case Code (Metric): 1005; Min Operating Temperature: -55°C; Max Operating Temperature: 125°C; Capacitance: 4.7nF; Dielectric: X7R; Voltage Rating: 50V; Voltage Rating (DC): 50V; Packaging: Tape and Reel; Package Quantity: 1; Termination: SMD/SMT; Series: CC; Construction: Flat; Length: 1mm; Width: 0.02inch; Height: 0.5mm; Thickness: 0.022inch; Depth: 0.5mm; Radiation Hardening: No; Reach SVHC Compliant: No; RoHS Compliant: Yes; Halogen Free: 5694HalogenFree; Lead Free: 5697LeadFree; ComponentLink1URL: https://datasheet.ciiva.com/7978/1489800-7978108.pdf?src-supplier=Element14; ComponentLink1Description: https://datasheet.ciiva.com/7978/1489800-7978108.pdf?src-supplier=Element14; ComponentLink2URL: https://datasheet.ciiva.com/176/mlccorderingcode-176364.pdf?src-supplier=Digikey; ComponentLink2Description: https://datasheet.ciiva.com/176/mlccorderingcode-176364.pdf?src-supplier=Digikey; ComponentLink3URL: https://datasheet.ciiva.com/176/mlccorderingcode-176363.pdf?src-supplier=Digikey; ComponentLink3Description: https://datasheet.ciiva.com/176/mlccorderingcode-176363.pdf?src-supplier=Digikey; ComponentLink4URL: https://datasheet.ciiva.com/176/mlccorderingcode-176365.pdf?src-supplier=Digikey; ComponentLink4Description: https://datasheet.ciiva.com/176/mlccorderingcode-176365.pdf?src-supplier=Digikey; ComponentLink5URL: https://datasheet.ciiva.com/11586/upy-gphc-x7r-6-3v-to-50v-8-11586491.pdf?src-supplier=Avnet; ComponentLink5Description: https://datasheet.ciiva.com/11586/upy-gphc-x7r-6-3v-to-50v-8-11586491.pdf?src-supplier=Avnet; Supplier Part Number 1: 1989300
D6 = PESD5V0H1BSFYL: TVS DIODE 5VWM 6.3VC DSN0603-2; Manufacturer: Nexperia; Supplier 1: Avnet; Manufacturer Part Number: PESD5V0H1BSFYL; RoHS: Yes; Category: ESD and Circuit Protection ICs; Stock 1: 9000; Pricing 1: 18000=0.06453, 36000=0.06278, 54000=0.06104, 90000=0.05930, 180000=0.05755, 900000=0.05581, 1800000=0.05406 (USD); RoHS Compliant: Yes; ComponentLink1URL: http://www.farnell.com/datasheets/1961312.pdf?src-supplier=Farnell; ComponentLink1Description: http://www.farnell.com/datasheets/1961312.pdf?src-supplier=Farnell; ComponentLink2URL: https://assets.nexperia.com/documents/data-sheet/PESD5V0H1BSF.pdf?src-supplier=Digi-Key; ComponentLink2Description: https://assets.nexperia.com/documents/data-sheet/PESD5V0H1BSF.pdf?src-supplier=Digi-Key; ComponentLink3URL: http://www.farnell.com/datasheets/1961312.pdf?src-supplier=Newark; ComponentLink3Description: http://www.farnell.com/datasheets/1961312.pdf?src-supplier=Newark; Supplier Part Number 1: PESD5V0H1BSFYL; LCSC Part Number: C477989; Item Type: Diode
R19 = RC0402FR-0733KL: RES 33K OHM 1% 1/16W 0402; Manufacturer: YAGEO; Item Type: Resistor; Manufacturer Part Number: RC0402FR-0733KL; Package: 0402; LCSC Part Number: C138003; ComponentLink1Description: LCSC; ComponentLink1URL: https://www.lcsc.com/product-detail/Chip-Resistor-Surface-Mount_YAGEO-RC0402FR-0733KL_C138003.html
R20 R22 = RTT0360R4FTP: 100mW Thick Film Resistors ±100ppm/℃ ±1% 60.4Ω 0603 Chip Resistor - Surface Mount ROHS; Manuacturer: RALEC; Manufacturer Part Number: RTT0360R4FTP; Package: 0603; Value: 60.4R; LCSC Part Number: C103744; ComponentLink1Description: LCSC; ComponentLink1URL: https://www.lcsc.com/product-detail/Chip-Resistor-Surface-Mount_RALEC-RTT0360R4FTP_C103744.html
R21 = RC0402FR-07100KL: RES 100K OHM 1% 1/16W 0402; Manufacturer: Yageo; Resistance: 100kR; Temperature Coefficient: 100ppm/°C; Power Rating: 63mW; Voltage Rating: 50V; Item Type: Resistor; Supplier 1: Mouser; Manufacturer Part Number: RC0402FR-07100KL; RoHS: Yes; Category: Chip SMD Resistors; Stock 1: 7759549; Pricing 1: 1=0.10000, 10=0.01200, 50=0.01200, 100=0.00500, 1000=0.00300, 2500=0.00200, 10000=0.00100 (USD); Case/Package: 0402; Case Code (Metric): 1005; Case Code (Imperial): 0402; Min Operating Temperature: -55°C; Max Operating Temperature: 155°C; Resistor Type: Thick Film; Tolerance: 1%; Packaging: Tape and Reel; Package Quantity: 1; Number of Terminations: 2; Termination: SMD/SMT; Max Power Dissipation: 63mW; Working Voltage: 50V; Features: Moisture Resistant; Series: RC; Resistance Tolerance: 1%; Construction: Rectangular; Technology: THICK FILM; Length: 0.039inch; Width: 0.02inch; Height: 0.016inch; Depth: 0.5mm; REACH SVHC: No SVHC; Lead Free: Lead Free; RoHS Compliant: Yes; Military Standard: Not; ComponentLink1URL: https://datasheet.ciiva.com/11819/0900766b80c66297-11819452.pdf?src-supplier=RSComponents; ComponentLink1Description: https://datasheet.ciiva.com/11819/0900766b80c66297-11819452.pdf?src-supplier=RSComponents; ComponentLink2URL: https://datasheet.ciiva.com/22747/1018594-22747509.pdf?src-supplier=Element14; ComponentLink2Description: https://datasheet.ciiva.com/22747/1018594-22747509.pdf?src-supplier=Element14; ComponentLink3URL: https://datasheet.ciiva.com/2453/pyu-r-int-thick-7-2453362.pdf?src-supplier=Digi-Key; ComponentLink3Description: https://datasheet.ciiva.com/2453/pyu-r-int-thick-7-2453362.pdf?src-supplier=Digi-Key; ComponentLink4URL: https://datasheet.ciiva.com/2453/pyu-r-int-thick-7-2453363.pdf?src-supplier=Digi-Key; ComponentLink4Description: https://datasheet.ciiva.com/2453/pyu-r-int-thick-7-2453363.pdf?src-supplier=Digi-Key; ComponentLink5URL: https://datasheet.ciiva.com/2453/pyu-r-int-thick-7-2453361.pdf?src-supplier=Digi-Key; ComponentLink5Description: https://datasheet.ciiva.com/2453/pyu-r-int-thick-7-2453361.pdf?src-supplier=Digi-Key; ComponentLink6URL: https://datasheet.ciiva.com/12667/pyu-rc0402-51-rohs-l-6-r-12667930.pdf?src-supplier=Mouser; ComponentLink6Description: https://datasheet.ciiva.com/12667/pyu-rc0402-51-rohs-l-6-r-12667930.pdf?src-supplier=Mouser; ComponentLink7URL: https://datasheet.ciiva.com/15189/getdatasheetpartid-323696-15189334.pdf?src-supplier=Verical; ComponentLink7Description: https://datasheet.ciiva.com/15189/getdatasheetpartid-323696-15189334.pdf?src-supplier=Verical; Supplier Part Number 1: 603-RC0402FR-07100KL; LCSC Part Number: C60491
TP6 TP7 = TEST POINT: Test Point ON; Item Type: TEST POINT
U5 = TCAN1463DMTRQ1: IC TRANSCEIVER HALF 1/1 14VSON; Manufacturer: Texas Instruments; Supplier: Mouser; Supplier Part Number: 595-TCAN1463DMTRQ1; Manufacturer Part Number: TCAN1463DMTRQ1; RoHS: Yes; Item Type: IC; Stock: 20610; Pricing: 1=2.47, 10=2.22, 50=2.22, 100=1.78, 1000=1.21, 10000=1.09 (USD); LCSC Part Number: C5215823

## Sheet RS485_RS232_Sheet.SchDoc
size 420 x 297 mm; SheetNumber: 5; SheetTotal: 32
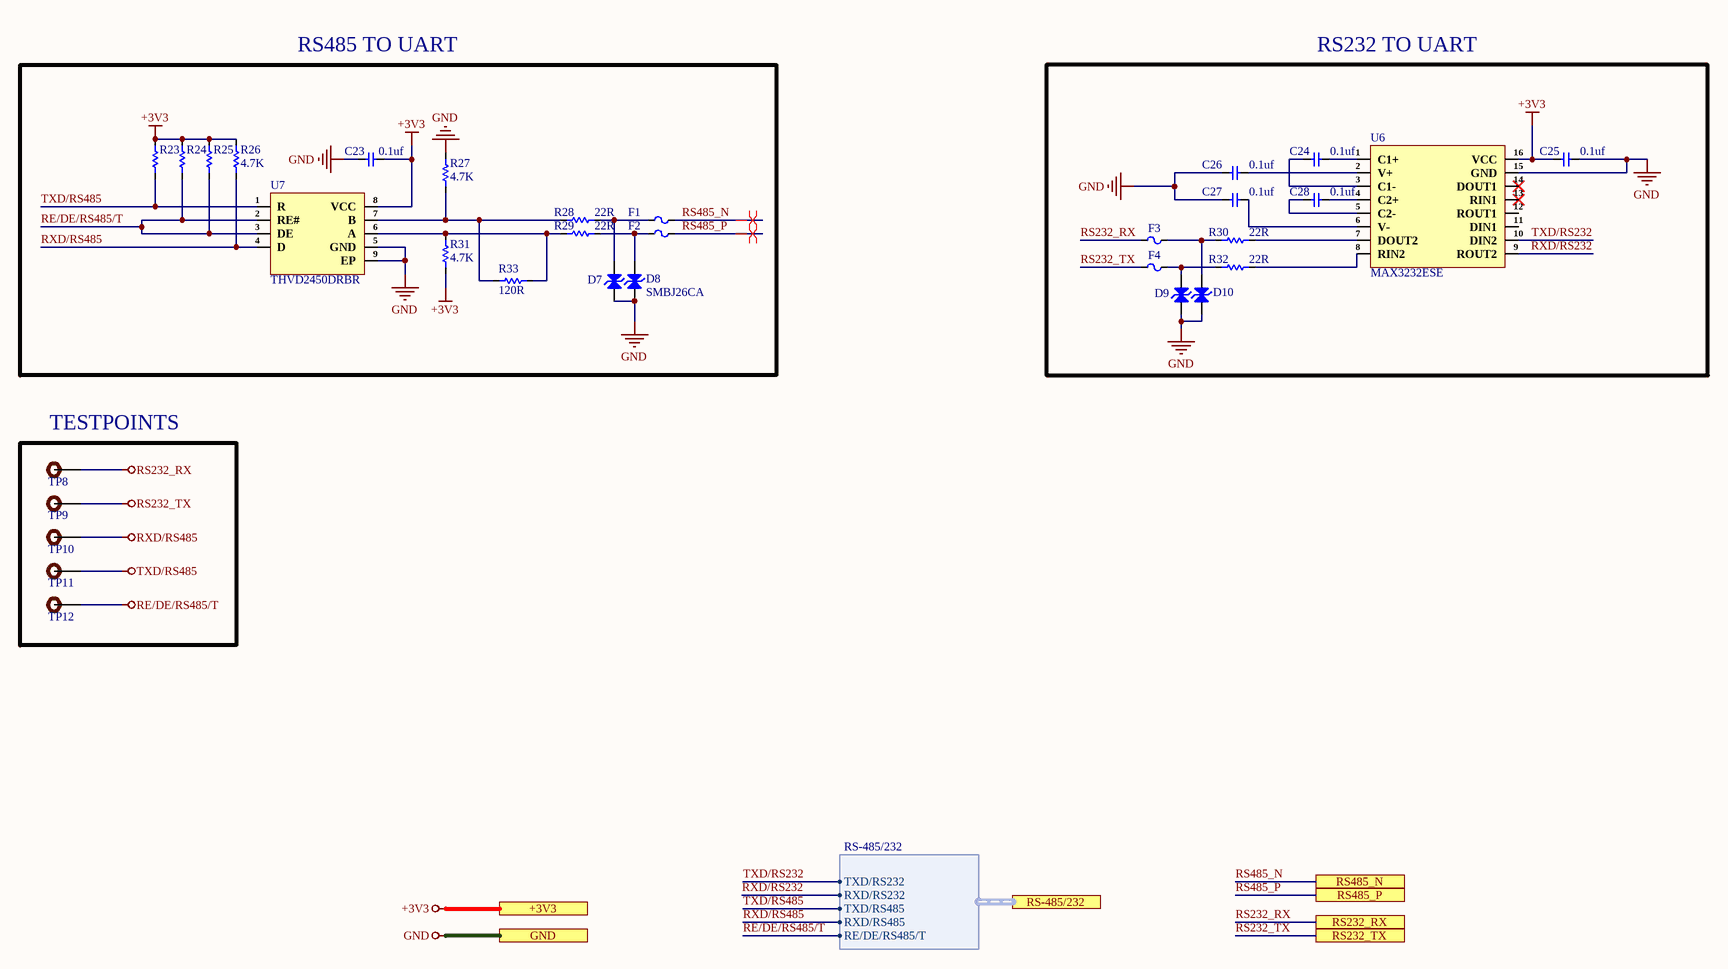
[diagram p4: RS485_RS232_Sheet.SchDoc]

### Parts
C23  0.1uf  [Cap-0402]
C24  0.1uf  [Cap-0402]
C25  0.1uf  [Cap-0402]
C26  0.1uf  [Cap-0402]
C27  0.1uf  [Cap-0402]
C28  0.1uf  [Cap-0402]
D7  SMBJ26CA  [SMB Bi Directional]  (value not drawn)
D8  SMBJ26CA  [SMB Bi Directional]
D9  SMBJ26CA  [SMB Bi Directional]  (value not drawn)
D10  SMBJ26CA  [SMB Bi Directional]  (value not drawn)
F1  SMD0805P020TF  [Fuse-0805]  (value not drawn)
F2  SMD0805P020TF  [Fuse-0805]  (value not drawn)
F3  SMD0805P020TF  [Fuse-0805]  (value not drawn)
F4  SMD0805P020TF  [Fuse-0805]  (value not drawn)
R23  4.7K  [Res-0402]  (value not drawn)
R24  4.7K  [Res-0402]  (value not drawn)
R25  4.7K  [Res-0402]  (value not drawn)
R26  4.7K  [Res-0402]
R27  4.7K  [Res-0402]
R28  22R  [Res-0201]
R29  22R  [Res-0201]
R30  22R  [Res-0201]
R31  4.7K  [Res-0402]
R32  22R  [Res-0201]
R33  120R  [Res-0603]
TP8  TEST POINT  [Test-point]  (value not drawn)  (no BOM)
TP9  TEST POINT  [Test-point]  (value not drawn)  (no BOM)
TP10  TEST POINT  [Test-point]  (value not drawn)  (no BOM)
TP11  TEST POINT  [Test-point]  (value not drawn)  (no BOM)
TP12  TEST POINT  [Test-point]  (value not drawn)  (no BOM)
U6  MAX3232ESE  [SOP-16]
U7  THVD2450DRBR  [SON-8-EP(3x3)]

### Ports
+3V3 (see Top_Sheet[4C], CAN_Sheet[5D], Connector_Sheet[5D], Controller_Sheet[5D], Encoder_Sheet1[5D], Encoder_Sheet2[5D], Encoder_Sheet3[5D], Encoder_Sheet4[5D], EtherCAT_Sheet[5D], Motor_Driver_Sheet1[5D], Motor_Driver_Sheet2[5D], Motor_Driver_Sheet3[5D], Motor_Driver_Sheet4[5D], Power_Sheet[5D], RJ45_Sheet[5D], Sec_Controller_Sheet1[5D], Sec_Controller_Sheet2[5D], Sec_Controller_Sheet3[5D], Sec_Controller_Sheet4[5D]), GND (see Top_Sheet[4C], CAN_Sheet[5D], Connector_Sheet[5D], Controller_Sheet[5D], DIO_1[5D], DIO_2[5D], DIO_3[5D], DIO_4[5D], Encoder_Sheet1[5D], Encoder_Sheet2[5D], Encoder_Sheet3[5D], Encoder_Sheet4[5D], EtherCAT_Sheet[5D], MOSFET_Driver_Sheet1[5D], MOSFET_Driver_Sheet2[5D], MOSFET_Driver_Sheet3[5D], MOSFET_Driver_Sheet4[5D], Motor_Driver_Sheet1[5D], Motor_Driver_Sheet2[5D], Motor_Driver_Sheet3[5D], Motor_Driver_Sheet4[5D], Power_Sheet[5D], RJ45_Sheet[5D], Sec_Controller_Sheet1[5D], Sec_Controller_Sheet2[5D], Sec_Controller_Sheet3[5D], Sec_Controller_Sheet4[5D]), RS232_RX (see Top_Sheet[4D], Connector_Sheet[3D]), RS232_TX (see Top_Sheet[4C], Connector_Sheet[3D]), RS485_N (see Top_Sheet[4D], Connector_Sheet[3D]), RS485_P (see Top_Sheet[4D], Connector_Sheet[3D]), RS-485/232 (harness RS-485/232, see Top_Sheet[4C], Controller_Sheet[4D])

### Harnesses
RS-485/232: TXD/RS232, RXD/RS232, TXD/RS485, RXD/RS485, RE/DE/RS485/T

### Nets
+3V3: C23.2 C25.2 R23.2 R24.2 R25.2 R26.2 R31.1 U6.16(VCC) U7.8(VCC) ; port +3V3
GND: C23.1 C25.1 C26.1 C27.1 D7.1(A) D8.1(A) D9.1(A) D10.1(A) R27.2 U6.15(GND) U7.5(GND) U7.9(EP) ; port GND
RE/DE/RS485/T: R24.1 R25.1 TP12.1 U7.2(RE#) U7.3(DE) ; port RS-485/232.RE/DE/RS485/T
RS232_RX: F3.1 TP8.1 ; port RS232_RX
RS232_TX: F4.1 TP9.1 ; port RS232_TX
RXD/RS485: R26.1 TP10.1 U7.4(D) ; port RS-485/232.RXD/RS485
TXD/RS485: R23.1 TP11.1 U7.1(R) ; port RS-485/232.TXD/RS485
RS485_N: F1.2 ; port RS485_N
RS485_P: F2.2 ; port RS485_P
RXD/RS232: U6.9(ROUT2) ; port RS-485/232.RXD/RS232
TXD/RS232: U6.10(DIN2) ; port RS-485/232.TXD/RS232
NetC24_1: C24.1 U6.1(C1+)
NetC24_2: C24.2 U6.3(C1-)
NetC26_2: C26.2 U6.2(V+)
NetC27_2: C27.2 U6.6(V-)
NetC28_1: C28.1 U6.4(C2+)
NetC28_2: C28.2 U6.5(C2-)
NetD7_2: D7.2(K) F1.1 R28.2
NetD8_2: D8.2(K) F2.1 R29.2
NetD9_2: D9.2(K) F4.2 R32.1
NetD10_2: D10.2(K) F3.2 R30.1
NetR27_1: R27.1 R28.1 R33.1 U7.7(B)
NetR29_1: R29.1 R31.2 R33.2 U7.6(A)
NetR30_2: R30.2 U6.7(DOUT2)
NetR32_2: R32.2 U6.8(RIN2)

Not connected (* = marked no-connect by the designer): U6 11(DIN1) 12(ROUT1) 13(RIN1)* 14(DOUT1)*

### Layout directives
differential pair; net class RS485; differential pair class RS485_LINES; rule Impedance Constraint [Min = 115.0    Max = 125.0    ]; rule Matched Net Lengths [Tolerance = 0.508mm]: RS485_N, RS485_P

### Notes on the sheet
- RS485 TO UART
- RS232 TO UART
- (near TP8) TESTPOINTS
- File:
- Title:
- Date:
- Page
- Num:
- Total:
- Drawn By: Huzaifa Ali

### Library data of the parts
C23-C28 = GRM155R62A104KE14D: CAP CER 0.1UF 100V X5R 0402; Manufacturer: Murata; Capacitance: 100nF; Tolerance: 10%; Item Type: Capacitor; Supplier 1: Arrow Electronics; Manufacturer Part Number: GRM155R62A104KE14D; RoHS: Yes; Category: Ceramic Capacitors; Stock 1: 870000; Pricing 1: 10000=0.00500, 20000=0.00410, 30000=0.00390, 50000=0.00370, 100000=0.00300 (USD); Mount: Surface Mount; Case/Package: 0402; Case Code (Metric): 1005; Case Code (Imperial): 0402; Weight: 0.000212oz; Min Operating Temperature: -55°C; Max Operating Temperature: 85°C; Packaging: Tape and Reel; Voltage Rating: 100V; Dielectric: X5R; Termination: SMD/SMT; Voltage Rating (DC): 100V; Package Quantity: 10000; Series: GRM; Length: 0.039inch; Width: 0.02inch; Height: 0.5mm; Thickness: 0.022inch; Reach SVHC Compliant: Yes; Lead Free: Lead Free; RoHS Compliant: Yes; ComponentLink1URL: http://www.farnell.com/datasheets/2079151.pdf?src-supplier=Farnell; ComponentLink1Description: http://www.farnell.com/datasheets/2079151.pdf?src-supplier=Farnell; ComponentLink2URL: http://www.mouser.com/ds/2/281/c02e-2905.pdf?src-supplier=Mouser; ComponentLink2Description: http://www.mouser.com/ds/2/281/c02e-2905.pdf?src-supplier=Mouser; ComponentLink3URL: http://www.farnell.com/datasheets/2079151.pdf?src-supplier=Element14; ComponentLink3Description: http://www.farnell.com/datasheets/2079151.pdf?src-supplier=Element14; ComponentLink4URL: http://search.murata.co.jp/Ceramy/image/img/A01X/G101/ENG/GRM155R62A104KE14-01.pdf?src-supplier=Digi-Key; ComponentLink4Description: http://search.murata.co.jp/Ceramy/image/img/A01X/G101/ENG/GRM155R62A104KE14-01.pdf?src-supplier=Digi-Key; ComponentLink5URL: http://www.farnell.com/datasheets/2079151.pdf?src-supplier=Newark; ComponentLink5Description: http://www.farnell.com/datasheets/2079151.pdf?src-supplier=Newark; Supplier Part Number 1: GRM155R62A104KE14D; LCSC Part Number: C162178
D7-D10 = SMBJ26CA: SMB(DO-214AA) TVS ROHS; Manufacturer: MSKSEMI; Item Type: Diode; Manufacturer Part Number: SMBJ26CA; Package: SMB(DO-214AA); LCSC Part Number: C5331111; ComponentLink1Description: LCSC; ComponentLink1URL: https://www.lcsc.com/product-detail/TVS_MSKSEMI-SMBJ26CA_C5331111.html
F1-F4 = SMD0805P020TF: 9V 200mA 100A 500mA 0805 Resettable Fuses ROHS; Manufacturer: RUILON; Item Type: Fuse; Manufacturer Part Number: SMD0805P020TF; Package: 0805; LCSC Part Number: C20976; ComponentLink1Description: LCSC; ComponentLink1URL: https://www.lcsc.com/product-detail/Resettable-Fuses_RUILON-Shenzhen-Ruilongyuan-Elec-SMD0805P020TF_C20976.html
R23-R27 R31 = RC0402FR-074K7L: RES 4.7K OHM 1% 1/16W 0402; Manufacturer: Yageo; Voltage Rating (DC): 50V; Power Rating: 62.5mW; Resistance: 4.7kR; Temperature Coefficient: 100ppm/°C; Max Power Dissipation: 63mW; Item Type: Resistor; Supplier 1: Avnet; Manufacturer Part Number: RC0402FR-074K7L; RoHS: Yes; Category: Chip SMD Resistors; Stock 1: 2420000; Pricing 1: 10000=0.00085 (USD); Case/Package: 0402; Number of Pins: 2; Case Code (Imperial): 0402; Case Code (Metric): 1005; Size Code: 0402; Min Operating Temperature: -55°C; Max Operating Temperature: 155°C; Tolerance: 1%; Voltage Rating: 50V; Packaging: Tape and Reel; Resistor Type: Thick Film; Termination: SMD/SMT; Features: Moisture Resistant; Series: RC; Number of Terminations: 2; Resistance Tolerance: 1%; Construction: Rectangular; Length: 1mm; Width: 0.5mm; Height: 0.32mm; Depth: 0.5mm; Height - Seated (Max): 0.016inch; RoHS Compliant: Yes; Reach SVHC Compliant: Yes; Military Standard: Not; Lead Free: Lead Free; ComponentLink1URL: https://datasheet.ciiva.com/22661/1686128-22661342.pdf?src-supplier=Element14; ComponentLink1Description: https://datasheet.ciiva.com/22661/1686128-22661342.pdf?src-supplier=Element14; ComponentLink2URL: https://datasheet.ciiva.com/7850/1018594-7850022.pdf?src-supplier=Element14; ComponentLink2Description: https://datasheet.ciiva.com/7850/1018594-7850022.pdf?src-supplier=Element14; ComponentLink3URL: https://datasheet.ciiva.com/7850/1018594-7850023.pdf?src-supplier=Element14; ComponentLink3Description: https://datasheet.ciiva.com/7850/1018594-7850023.pdf?src-supplier=Element14; ComponentLink4URL: https://datasheet.ciiva.com/15215/getdatasheetpartid-328119-15215035.pdf?src-supplier=Verical; ComponentLink4Description: https://datasheet.ciiva.com/15215/getdatasheetpartid-328119-15215035.pdf?src-supplier=Verical; Supplier Part Number 1: RC0402FR-074K7L; LCSC Part Number: C105871
R28-R30 R32 = RC0201FR-0722RL: RES 22 OHM 1% 1/20W 0201; Manufacturer: Yageo; Item Type: Resistor; Supplier: Future Electronics; Supplier Part Number: 5973409; Manufacturer Part Number: RC0201FR-0722RL; RoHS: Yes; Category: Chip SMD Resistors; Stock: 17980000; Pricing: 10000=0.0014, 50000=0.0013, 250000=0.0013, 750000=0.0012, 2000000=0.0011 (USD); ComponentLink1URL: https://datasheet.ciiva.com/7672/1563626-7672215.pdf?src-supplier=Element14; ComponentLink1Description: https://datasheet.ciiva.com/7672/1563626-7672215.pdf?src-supplier=Element14; LCSC Part Number: C155743
R33 = RC0603JR-07120RL: RES 120 OHM 5% 1/10W 0603; Manufacturer: Yageo; Voltage Rating (AC): 50V; Item Type: Resistor; Supplier: Future Electronics; Supplier Part Number: 4045720; Manufacturer Part Number: RC0603JR-07120RL; RoHS: Yes; Category: Chip SMD Resistors; Stock: 570000; Pricing: 5000=0.0015, 75000=0.0015, 250000=0.0014, 750000=0.0013, 2500000=0.0012 (USD); ComponentLink1URL: https://datasheet.ciiva.com/15189/getdatasheetpartid-326532-15189850.pdf?src-supplier=Verical; ComponentLink1Description: https://datasheet.ciiva.com/15189/getdatasheetpartid-326532-15189850.pdf?src-supplier=Verical; ComponentLink2URL: https://datasheet.ciiva.com/2518/pyu-r-int-thick-7-2518850.pdf?src-supplier=Digi-Key; ComponentLink2Description: https://datasheet.ciiva.com/2518/pyu-r-int-thick-7-2518850.pdf?src-supplier=Digi-Key; ComponentLink3URL: https://datasheet.ciiva.com/2518/pyu-r-int-thick-7-2518851.pdf?src-supplier=Digi-Key; ComponentLink3Description: https://datasheet.ciiva.com/2518/pyu-r-int-thick-7-2518851.pdf?src-supplier=Digi-Key; ComponentLink4URL: https://datasheet.ciiva.com/2518/pyu-r-int-thick-7-2518852.pdf?src-supplier=Digi-Key; ComponentLink4Description: https://datasheet.ciiva.com/2518/pyu-r-int-thick-7-2518852.pdf?src-supplier=Digi-Key; ComponentLink5URL: https://datasheet.ciiva.com/46395/443971-46395070.pdf?src-supplier=Element14; ComponentLink5Description: https://datasheet.ciiva.com/46395/443971-46395070.pdf?src-supplier=Element14; ComponentLink6URL: https://datasheet.ciiva.com/12555/rc0603-272842-12555246.pdf?src-supplier=Mouser; ComponentLink6Description: https://datasheet.ciiva.com/12555/rc0603-272842-12555246.pdf?src-supplier=Mouser; LCSC Part Number: C114681
TP8-TP12 = TEST POINT: Test Point ON; Item Type: TEST POINT
U6 = MAX3232ESE: 250Kbps transceiver 2/2 SOP-16 RS232 ICs ROHS; Manufacturer: UMW; Item Type: IC; Manufacturer Part Number: MAX3232ESE; Package: SOP-16; LCSC Part Number: C2904738; ComponentLink1Description: LCSC; ComponentLink1URL: https://www.lcsc.com/product-detail/RS232-ICs_UMW-Youtai-Semiconductor-Co-Ltd-MAX3232ESE_C2904738.html
U7 = THVD2450DRBR: IC TRANSCEIVER HALF 1/1 8SON; Manufacturer: Texas Instruments; Supplier: Digikey; Supplier Part Number: 296-THVD2450DRBRCT-ND; Manufacturer Part Number: THVD2450DRBR; RoHS: Yes; Item Type: IC; Stock: 2652; Pricing: 1=4.05, 10=3.639, 25=3.4404, 100=2.9818, 250=2.82892, 500=2.53838, 1000=2.1408 (USD); Pins: 8NUMBER; Length: 3mm; Width: 3mm; Height: 1mm; Thickness: 880um; LCSC Part Number: C2878080